# EAGLE design r2c (EAGLE 7.3.0)
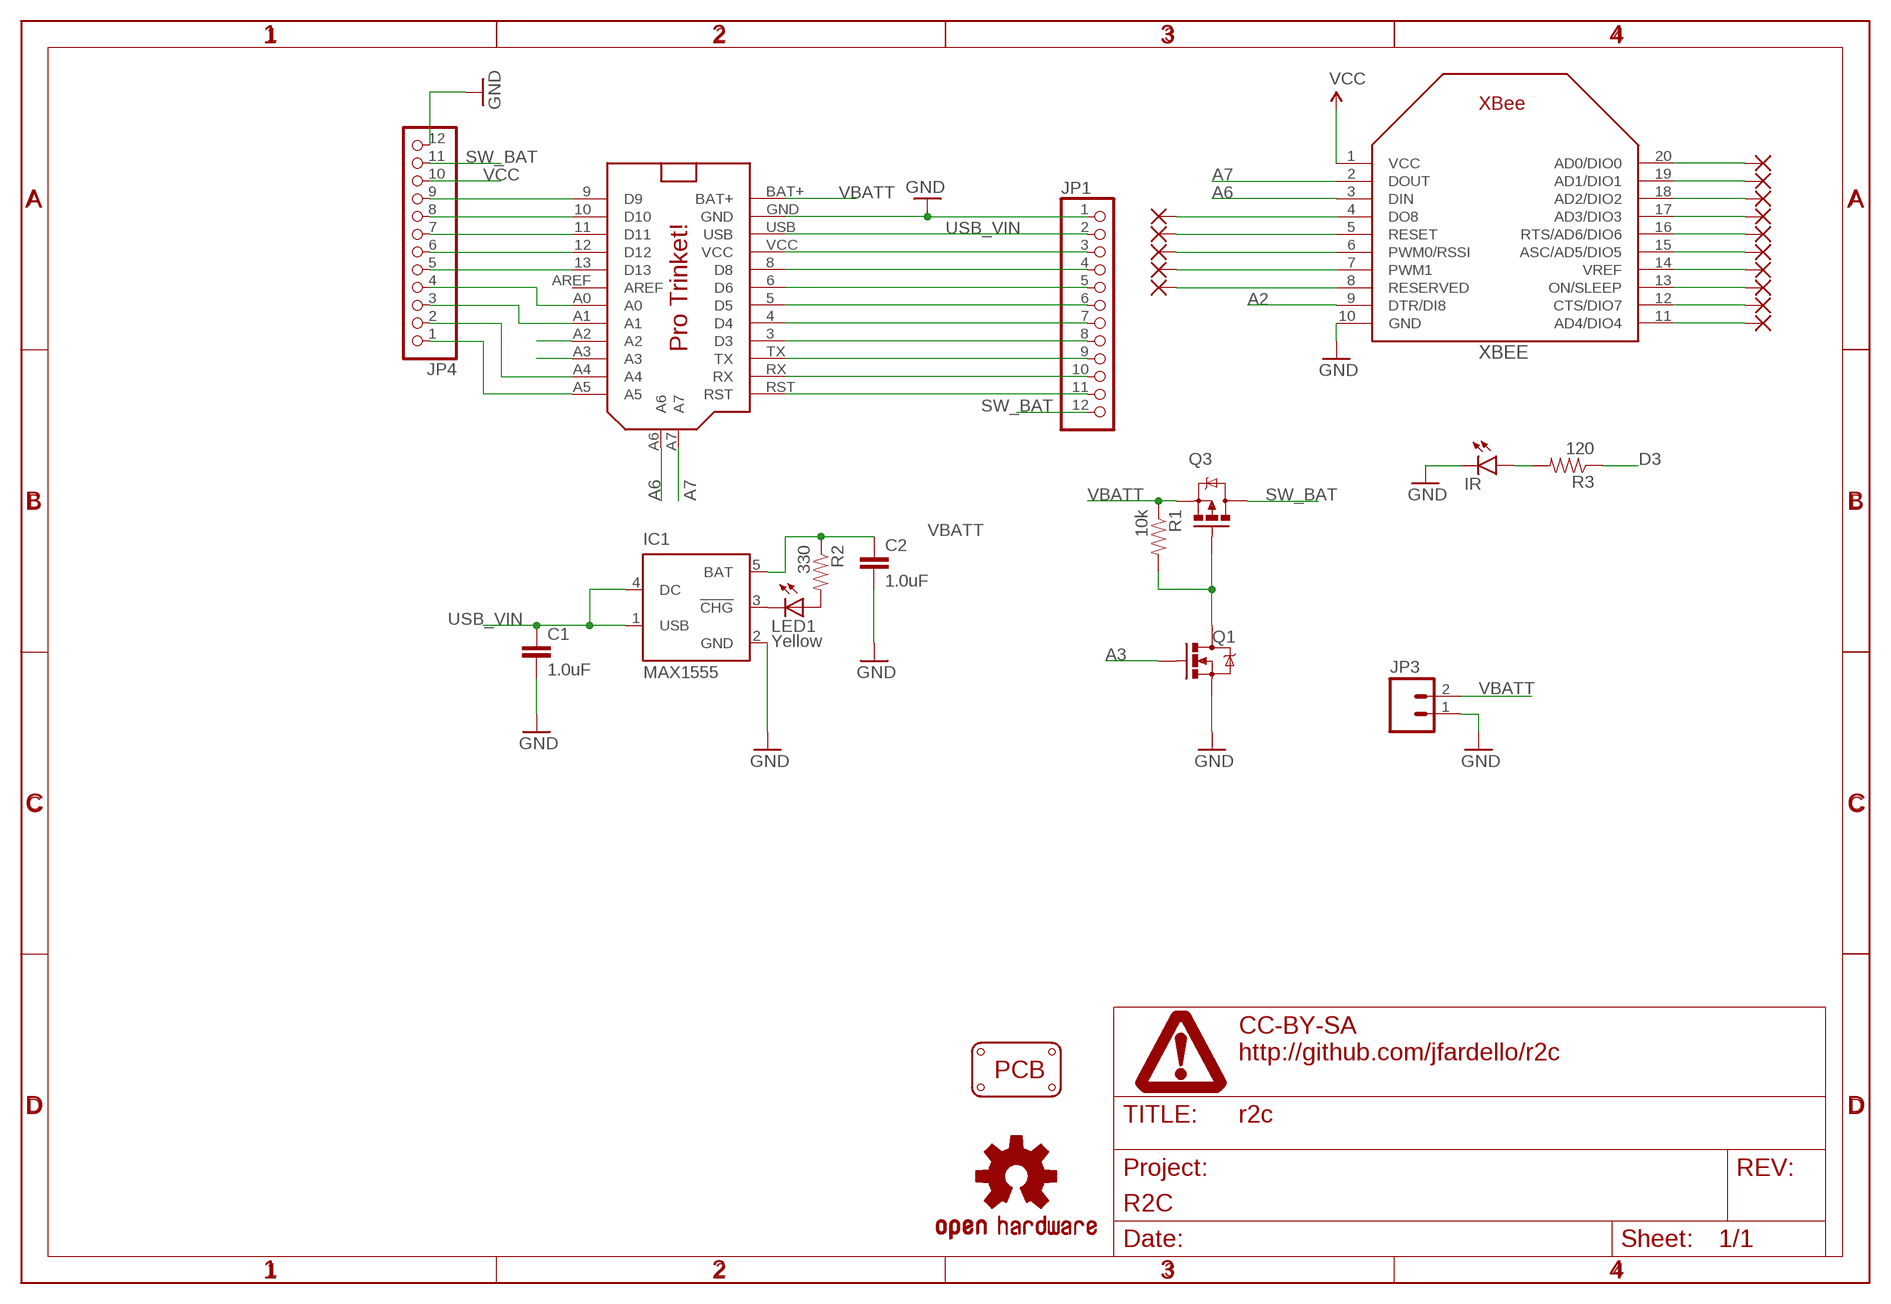
[diagram p0: schematic, sheet 1]

## Parts
C1  1.0uF  CAP0402-CAP  [0402-CAP]
C2  1.0uF  CAP0402-CAP  [0402-CAP]
IC1  MAX1555  [SOT23-5L]
IR  LED3MM  [LED3MM]
JP1  PINHD-1X12  [1X12]
JP3  M02-JST-2MM-SMT  [S2B-PH]
JP4  PINHD-1X12  [1X12]
LED1  Yellow  LED0603  [LED-0603]
LOGO1  OSHW-LOGOS  [OSHW-LOGO-S]
PAD1  SMD2  [SMD1,27-2,54]
PAD2  SMD2  [SMD1,27-2,54]
PAD3  SMD2  [SMD1,27-2,54]
PAD4  SMD2  [SMD1,27-2,54]
PAD5  SMD2  [SMD1,27-2,54]
PAD6  SMD2  [SMD1,27-2,54]
PAD7  SMD2  [SMD1,27-2,54]
PAD8  SMD2  [SMD1,27-2,54]
PAD9  SMD2  [SMD1,27-2,54]
PAD10  SMD2  [SMD1,27-2,54]
PAD11  SMD2  [SMD1,27-2,54]
PAD12  SMD2  [SMD1,27-2,54]
PAD13  SMD2  [SMD1,27-2,54]
PAD14  SMD2  [SMD1,27-2,54]
PAD15  SMD2  [SMD1,27-2,54]
PCB1  PCB_DP_RECTANGLE-37X60  [DP6037_V1]
Q1  MOSFET-NCHANNEL2N7002PW  [SOT323]
Q3  MOSFET-PCHANNELIRLML2244  [SOT23-3]
R1  10k  RESISTOR0402-RES  [0402-RES]
R2  330  RESISTOR0402-RES  [0402-RES]
R3  120  RESISTOR0402-RES  [0402-RES]
U$1  PRO_TRINKET  [PROTRINKET]
U$2  FRAME_DINA4_L  [DP_LOGO]
XBEE  XBEE  [XBEE]

## Nets
A2: U$1.A2 XBEE.9(DTR/DI8)
A3: Q1.1(G) U$1.A3
A4: JP4.2 U$1.A4
A5: JP4.1 U$1.A5
A6: U$1.A6 XBEE.3(DIN)
A7: U$1.A7 XBEE.2(DOUT)
D3: JP1.8 R3.1 U$1.3(D3)
GND: C1.2 C2.2 IC1.2(GND) IR.K(C) JP1.1 JP3.1 JP4.12 Q1.2(S) U$1.GND XBEE.10(GND)
N$1: Q1.3(D) Q3.1(G) R1.2
N$2: IR.A R3.2
N$3: JP1.4 U$1.8(D8)
N$4: IC1.3(!CHG) LED1.C
N$5: LED1.A R2.2
N$6: JP1.5 U$1.6(D6)
N$7: PAD1.1(P) XBEE.20(AD0/DIO0)
N$8: JP1.6 U$1.5(D5)
N$9: JP1.7 U$1.4(D4)
N$10: PAD2.1(P) XBEE.19(AD1/DIO1)
N$11: JP1.9 U$1.TX
N$12: JP1.10 U$1.RX
N$13: JP1.11 U$1.RST
N$14: PAD3.1(P) XBEE.18(AD2/DIO2)
N$15: PAD4.1(P) XBEE.17(AD3/DIO3)
N$16: PAD5.1(P) XBEE.16(RTS/AD6/DIO6)
N$17: PAD6.1(P) XBEE.15(ASC/AD5/DIO5)
N$18: JP4.3 U$1.A1
N$19: JP4.4 U$1.A0
N$20: PAD7.1(P) XBEE.14(VREF)
N$21: JP4.5 U$1.13(D13)
N$22: JP4.6 U$1.12(D12)
N$23: JP4.7 U$1.11(D11)
N$24: JP4.8 U$1.10(D10)
N$25: JP4.9 U$1.9(D9)
N$26: PAD8.1(P) XBEE.13(ON/SLEEP)
N$27: PAD9.1(P) XBEE.12(CTS/DIO7)
N$28: PAD10.1(P) XBEE.11(AD4/DIO4)
N$29: PAD11.1(P) XBEE.4(DO8)
N$30: PAD12.1(P) XBEE.5(RESET)
N$31: PAD13.1(P) XBEE.6(PWM0/RSSI)
N$32: PAD14.1(P) XBEE.7(PWM1)
N$33: PAD15.1(P) XBEE.8(RESERVED)
SW_BAT: JP1.12 JP4.11 Q3.3(D)
USB_VIN: C1.1 IC1.1(USB) IC1.4(DC) JP1.2 U$1.USB
VBATT: C2.1 IC1.5(BAT) JP3.2 Q3.2(S) R1.1 R2.1 U$1.BAT+
VCC [VCC]: JP1.3 JP4.10 U$1.VCC XBEE.1(VCC)
Unconnected: U$1.AREF

## Library data of the parts
C1 C2 = SparkFun:CAP: Capacitor Standard 0603 ceramic capacitor, and 0.1" leaded capacitor.
IC1 = maxim:MAX1555: Dual-Input USB/AC Adapter 1-Cell Li+ Battery Chargers Source: http://www.maxim-ic.com .. MAX1551-MAX1555.pdf; MF: MAXIM; MPN: MAX1555EZK+T; OC_FARNELL: 1628222; OC_NEWARK: 59J2761
IR = SparkFun-LED:LED: LEDs Standard schematic elements and footprints for 5mm, 3mm, 1206, and 0603 sized LEDs. 5mm - Spark Fun Electronics SKU : COM-00529 (and others)
JP1 JP4 = pinhead:PINHD-1X12: PIN HEADER
JP3 = SparkFun:M02: Header 2 Standard 2-pin 0.1" header. Use with straight break away headers (SKU : PRT-00116), right angle break away headers (PRT-00553), swiss pins (PRT-00743), machine pins (PRT-00117), and female headers (PRT-00115). Molex polarized connector foot print use with SKU : PRT-08233 with associated crimp pins and housings.
LED1 = SparkFun:LED: LEDs Standard schematic elements and footprints for 5mm, 3mm, 1206, and 0603 sized LEDs. 5mm - Spark Fun Electronics SKU : COM-00529 (and others)
LOGO1 = SparkFun-Aesthetics:OSHW-LOGO: Open Source Hardware Logo This logo indicates the piece of hardware it is found on incorporates a OSHW license and/or adheres to the definition of open source hardware found here: http://freedomdefined.org/OSHW
PAD1-PAD15 = wirepad:SMD2: SMD PAD
PCB1 = dp_devices:PCB_DP_RECTANGLE: Dangerous Prototypes Standard Rectangular PCB sizes; PCB_SIZE: DP6037_V1
Q1 = SparkFun-DiscreteSemi:MOSFET-NCHANNEL: Common NMOSFET Parts MFG P/N Store ID Prod ID FDD8780 TRANS-09984 SI7820DN TRANS-11055 FDS6630A IC-08089 2N7002PW TRANS-11151 FQP30N06L COM-10213 TRANS-10060 BSS123LT1G TRANS-08345 BSS138 TRANS-00830 BS170 2N7000; PROD_ID: TRANS-11151
Q3 = SparkFun-DiscreteSemi:MOSFET-PCHANNEL: Generic PMOSFET IRLML2244 - TRANS-11153 (SOT-23 -20V -4.3A) (1.Gate 2.Source 3.Drain) FQP27P06 - COM-10349 <http://www.sparkfun.com/products/10349> (TO-220 -60V -27A) (1.Gate 2.Source 3.Drain); PROD_ID: TRANS-11153
R1-R3 = SparkFun:RESISTOR: Resistor Basic schematic elements and footprints for 0603, 1206, and PTH 1/10th watt (small) resistors.
U$1 = adafruit:PRO_TRINKET
U$2 = dp_devices:FRAME_DINA4_L: A4 DP frame Standard Dangerous Prototypes schematic frame. Automagically adds the DP logo and standard texts to the PCB Use the atrribute in the schematic editor to change the fields.; FF1: fulfillment by; FF2: Seeed Studio; FF3: www.seeedstudio.com; LICENSE: CC-BY-SA; PROJECT: R2C; URL1: http://github.com/jfardello/r2c
XBEE = adafruit:XBEE

## Net classes
0 Default: width 0.203 mm
1 VCC: width 0.381 mm
2 LEDPower: width 0.203 mm
3 ButtonSignal: width 0.203 mm

## Board
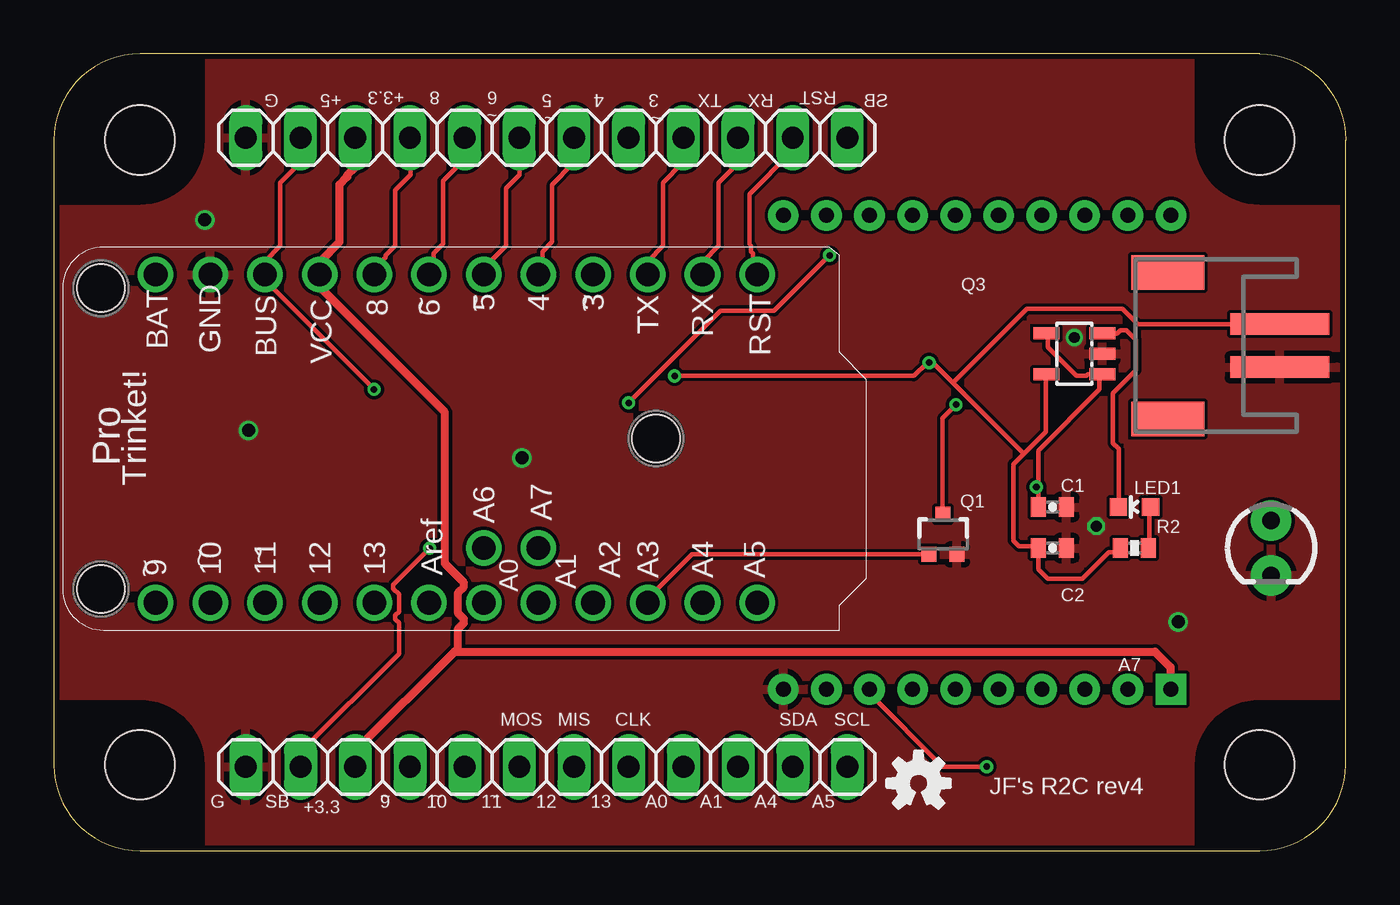
[diagram p1: board, top side]
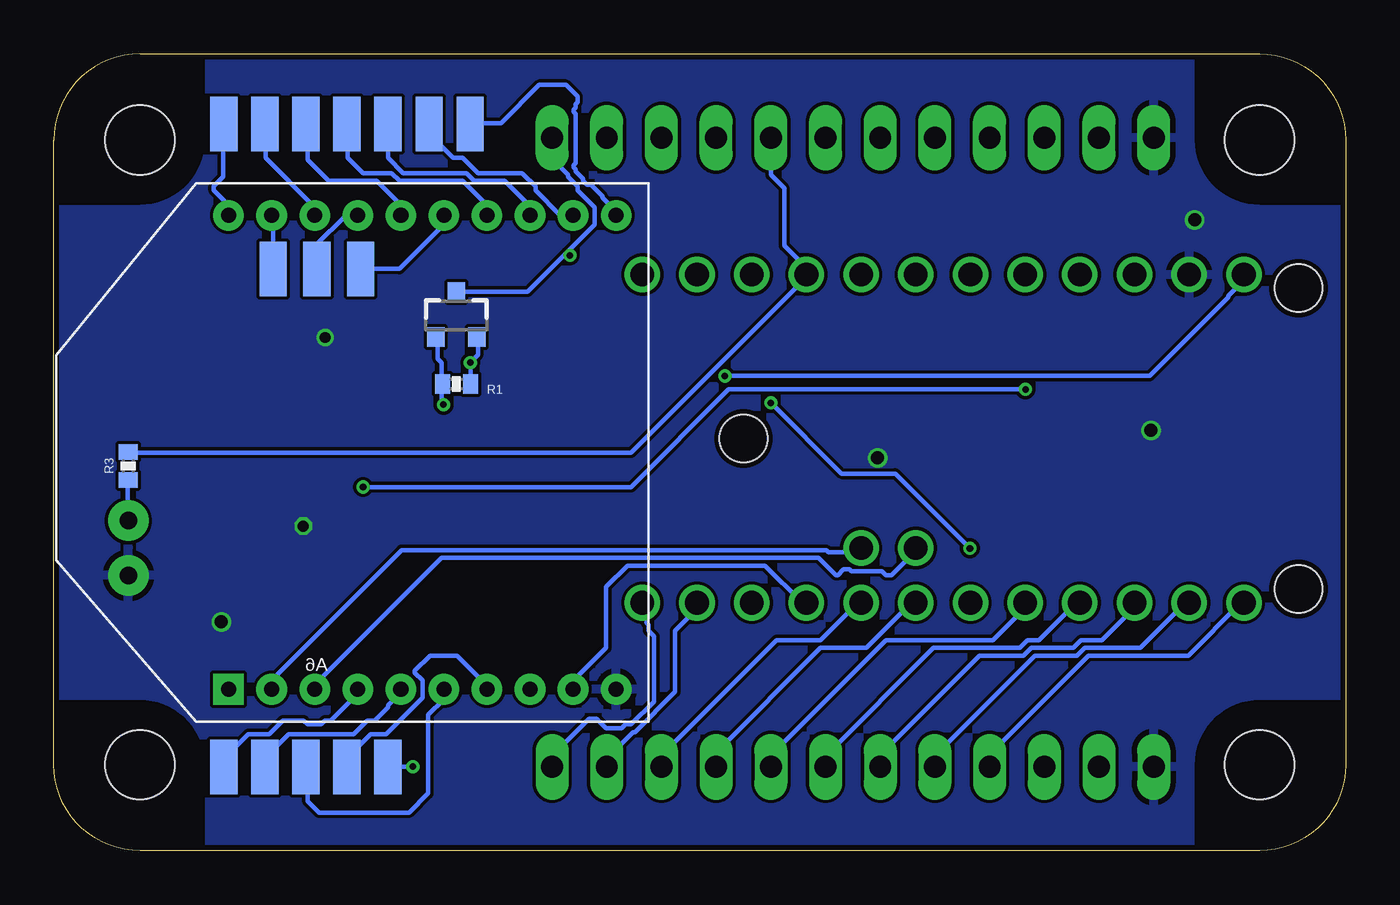
[diagram p2: board, bottom side, seen from below]

Size 60 x 37 mm. Coordinates in mm from the lower left corner, seen from the top.
Copper layers (1*16): Top 0.035mm / dielectric 1.5mm / Bottom 0.035mm
Design rules "SeeedStudio_2layer_DRU_no_angle_20140221 *": minimum track width 6mil, minimum drill 12mil, track to track 6mil, track to pad 6mil, pad to pad 6mil, via to via 6mil, smd to smd 0mil, copper to edge 10mil, drill to drill 10mil, minimum pad ring 10mil, minimum via ring 6mil, stop-mask expansion 2mil, vias tented up to drill 100mil, thermal gap 10mil

### Footprints (pad centres in the part's own frame; a part is rotated, then mirrored left to right if it is on the bottom)
0402-CAP = smd 0.7 x 0.9: 1 -0.65,0; 2 0.65,0
SOT23-5L = smd 0.55 x 1.2: 1 -0.95,-1.3; 2 0,-1.3; 3 0.95,-1.3; 4 0.95,1.3; 5 -0.95,1.3
LED3MM = drill 0.813 pad 1.88: A -1.27,0; K 1.27,0
1X12 = drill 1.016 long: 1 -13.97,0; 2 -11.43,0; 3 -8.89,0; 4 -6.35,0; 5 -3.81,0; 6 -1.27,0; 7 1.27,0; 8 3.81,0; 9 6.35,0; 10 8.89,0; 11 11.43,0; 12 13.97,0
S2B-PH = smd 1 x 4.6: 1 -1,-3.7; 2 1,-3.7 | smd 1.6 x 3.4: NC1 -3.4,1.5; NC2 3.4,1.5
LED-0603 = smd 0.8 x 0.8: A 0,-0.75; C 0,0.75
SMD1,27-2,54 = smd 1.27 x 2.54: 1 0,0
DP6037_V1 = hole 3.2: -26,-14.5; 26,-14.5; 26,14.5; -26,14.5
SOT323 = smd 0.7 x 0.7: 1 -0.65,-0.925; 2 0.65,-0.925; 3 0,0.925
SOT23-3 = smd 0.8 x 0.9: 1 -0.95,-1; 2 0.95,-1; 3 0,1.1
0402-RES = smd 0.7 x 0.9: 1 -0.65,0; 2 0.65,0
PROTRINKET = drill 1.1: 3 7.62,2.921; 4 7.62,5.461; 5 7.62,8.001; 6 7.62,10.541; 8 7.62,13.081; 9 -7.62,23.241; 10 -7.62,20.701; 11 -7.62,18.161; 12 -7.62,15.621; 13 -7.62,13.081; A0 -7.62,8.001; A1 -7.62,5.461; A2 -7.62,2.921; A3 -7.62,0.381; A4 -7.62,-2.159; A5 -7.62,-4.699; A6 -5.08,8.001; A7 -5.08,5.461; AREF -7.62,10.541; BAT+ 7.62,23.241; GND 7.62,20.701; RST 7.62,-4.699; RX 7.62,-2.159; TX 7.62,0.381; USB 7.62,18.161; VCC 7.62,15.621 | hole 2.2: -6.985,25.781; 6.985,25.781; 0,0
XBEE = drill 0.7 pad 1.422 square: 1 -11,5.5 | drill 0.7 pad 1.422: 2 -11,3.5; 3 -11,1.5; 4 -11,-0.5; 5 -11,-2.5; 6 -11,-4.5; 7 -11,-6.5; 8 -11,-8.5; 9 -11,-10.5; 10 -11,-12.5; 11 11,-12.5; 12 11,-10.5; 13 11,-8.5; 14 11,-6.5; 15 11,-4.5; 16 11,-2.5; 17 11,-0.5; 18 11,1.5; 19 11,3.5; 20 11,5.5

### Placement (x,y rotation side)
C1  46.38,15.96 0 top
C2  46.38,14.06 0 top
IC1  47.4,23.07 90 top
IR  56.54,14.06 270 top
JP1  22.89,33.11 0 top
JP3  53.24,23.45 90 top
JP4  22.89,3.9 180 top
LED1  50.19,15.96 90 top
LOGO1  40.16,3.13 0 top
PAD1  52.1,33.74 0 bottom
PAD2  49.81,27.01 0 bottom
PAD3  50.19,33.74 0 bottom
PAD4  47.78,27.01 0 bottom
PAD5  48.29,33.74 0 bottom
PAD6  45.75,27.01 0 bottom
PAD7  46.38,33.74 0 bottom
PAD8  44.48,33.74 0 bottom
PAD9  42.57,33.74 0 bottom
PAD10  40.67,33.74 0 bottom
PAD11  52.1,3.9 0 bottom
PAD12  50.19,3.9 0 bottom
PAD13  48.29,3.9 0 bottom
PAD14  46.38,3.9 0 bottom
PAD15  44.48,3.9 0 bottom
PCB1  30,18.5 0 top
Q1  41.3,14.69 0 top
Q3  41.3,24.85 0 bottom
R1  41.3,21.68 180 bottom
R2  50.19,14.06 0 top
R3  56.54,17.87 270 bottom
U$1  27.97,19.14 90 top
U$2  2.57,-6.26 0 top  (outside the outline)
XBEE  46.38,18.5 90 bottom

### Tracks (layer width: path | path; a pad name or v marks a point on that pad's centre or on a via)
A2
  Bottom 0.203: XBEE.9 35.85,7.55 35.85,7.91 34.34,9.42 34.34,12.26 33.37,13.24 26.96,13.24 25.28,11.55 25.1,11.55 U$1.A2
A3
  Top 0.203: U$1.A3 27.59,11.73 29.63,13.78 40.57,13.78 Q1.1
A4
  Bottom 0.203: JP4.2 34.25,3.91 34.25,4.35 33.1,5.51 33.01,5.51 31.14,7.38 31.14,10.22 30.16,11.2 30.16,11.46 U$1.A4
A5
  Bottom 0.203: JP4.1 36.83,3.91 36.83,4.44 35.14,6.13 34.79,6.13 34.34,5.69 33.63,5.69 33.45,5.86 33.19,5.86 32.12,6.93 32.12,9.95 32.39,10.22 32.39,10.49 32.48,10.58 32.48,11.29 32.65,11.46 U$1.A5
A6
  Bottom 0.203: XBEE.3 47.86,7.55 47.86,7.73 41.99,13.6 24.48,13.6 23.67,12.8 23.59,12.8 23.32,13.06 23.05,13.06 22.96,12.98 21.54,12.98 21.36,12.8 21.1,12.8 20.03,13.87 20.03,14.04 U$1.A6
A7
  Bottom 0.203: XBEE.2 49.81,7.55 49.81,8 43.86,13.95 24.12,13.95 24.03,13.87 23.32,13.87 23.14,14.04 22.52,14.04 U$1.A7
D3
  Bottom 0.203: R3.1 56.48,18.49 33.19,18.49 25.1,26.58 25.1,26.76 U$1.3 25.1,26.84 25.1,27.11 26.08,28.09 26.08,30.76 26.7,31.38 JP1.8
GND  (via drill 0.5, 0.6)
  other vias: 7.01,29.3 48.41,15.07 21.74,18.25 9.04,19.52 47.4,23.83 52.23,10.63
  pour Bottom: -1.88,38.82 62.89,38.82 62.89,37.55 62.89,-1.82 -2.51,-1.82 -2.51,-1.18 -2.51,38.82
  pour Top: -3.15,39.45 64.16,39.45 64.16,37.55 64.16,-3.09 -3.15,-3.09 -3.15,-2.45
N$1  (via drill 0.3)
  Top 0.203: v41.9,20.71 41.28,20.09 41.28,15.64 Q1.3
  Bottom 0.203: v41.9,20.71 41.99,20.8 41.99,21.6 R1.2 41.99,21.69 41.99,22.67 42.17,22.84 42.17,23.82 Q3.1
N$2
  Bottom 0.203: R3.2 56.57,17.15 56.57,15.38 IR.A
N$3
  Top 0.203: JP1.4 16.56,33.07 16.56,31.38 15.85,30.67 15.85,28.09 15.41,27.64 15.41,27.55 14.96,27.11 14.96,26.76 U$1.8
N$4
  Top 0.203: LED1.C 49.46,16 49.46,18.66 49.19,18.93 49.19,21.24 50.26,22.31 50.26,23.73 49.81,24.18 49.55,24.18 49.37,24 48.74,24 IC1.3
N$5
  Top 0.203: LED1.A 50.88,15.91 50.88,14.13 R2.2
N$6
  Top 0.203: JP1.5 19.05,33.07 19.05,32.09 18.07,31.11 18.07,28.18 17.63,27.73 17.63,27.55 17.45,27.38 17.45,26.76 U$1.6
N$7
  Bottom 0.203: PAD1.1 52.12,33.69 52.12,31.29 52.57,30.84 52.57,30.67 51.95,30.04 51.95,29.51 XBEE.20
N$8
  Top 0.203: JP1.6 21.63,33.07 21.63,31.38 21.01,30.76 21.01,28.09 20.03,27.11 20.03,26.76 U$1.5
N$9
  Top 0.203: JP1.7 24.12,33.07 24.12,31.91 23.14,30.93 23.14,28.27 22.7,27.82 22.7,27.55 22.52,27.38 22.52,26.76 U$1.4
N$10
  Bottom 0.203: PAD2.1 49.81,29.42 XBEE.19
N$11
  Top 0.203: U$1.TX 27.59,27.38 28.3,28.09 28.3,31.02 29.19,31.91 29.19,33.07 JP1.9
N$12
  Top 0.203: JP1.10 31.76,33.07 31.76,31.91 30.88,31.02 30.88,28.09 30.16,27.38 30.16,26.76 U$1.RX
N$13
  Top 0.203: JP1.11 34.25,33.07 34.25,32.45 32.3,30.49 32.3,28.18 32.39,28.09 32.39,27.82 32.48,27.73 32.48,27.55 32.65,27.38 32.65,26.76 U$1.RST
N$14
  Bottom 0.203: PAD3.1 50.17,33.69 50.17,32.18 47.95,29.96 47.95,29.51 XBEE.18
N$15
  Bottom 0.203: PAD4.1 47.77,27.02 47.77,28.18 46.52,29.42 45.9,29.42 XBEE.17
N$16
  Bottom 0.203: PAD5.1 48.21,33.69 48.21,32.09 47.23,31.11 45.01,31.11 43.95,30.04 43.95,29.51 XBEE.16
N$17
  Bottom 0.203: PAD6.1 45.72,27.02 43.95,27.02 41.9,29.07 41.9,29.42 XBEE.15
N$18
  Bottom 0.203: JP4.3 31.76,3.91 31.76,4.44 26.43,9.78 24.39,9.78 22.7,11.46 22.52,11.46 U$1.A1
N$19
  Bottom 0.203: JP4.4 29.19,3.91 29.19,4.62 24.39,9.42 22.25,9.42 20.21,11.46 20.03,11.46 U$1.A0
N$20
  Bottom 0.203: PAD7.1 46.34,33.69 46.34,32.18 45.63,31.47 44.3,31.47 43.95,31.11 41.01,31.11 39.94,30.04 39.94,29.51 XBEE.14
N$21
  Bottom 0.203: JP4.5 26.7,4.44 21.36,9.78 16.39,9.78 14.96,11.2 14.96,11.46 U$1.13
N$22
  Bottom 0.203: JP4.6 24.12,3.91 24.12,4.44 19.14,9.42 15.14,9.42 14.78,9.78 14.25,9.78 12.56,11.46 12.38,11.46 U$1.12
N$23
  Bottom 0.203: U$1.11 9.81,11.29 11.32,9.78 12.3,9.78 12.65,9.42 14.61,9.42 14.96,9.06 17.01,9.06 21.54,4.53 21.54,3.91 JP4.7
N$24
  Bottom 0.203: JP4.8 19.05,3.91 19.05,4.44 14.43,9.06 12.47,9.06 12.12,9.42 9.54,9.42 7.5,11.46 7.32,11.46 U$1.10
N$25
  Bottom 0.203: JP4.9 16.47,3.91 16.47,4.53 11.94,9.06 7.32,9.06 4.92,11.46 4.74,11.46 U$1.9
N$26
  Bottom 0.203: PAD8.1 44.48,32.18 43.77,31.47 40.83,31.47 40.48,31.11 39.05,31.11 37.9,29.96 37.9,29.51 XBEE.13
N$27
  Bottom 0.203: PAD9.1 42.52,33.69 42.52,33.24 41.45,32.18 41.01,32.18 40.3,31.47 38.25,31.47 37.63,30.84 37.63,30.67 36.48,29.51 35.94,29.51 XBEE.12
N$28
  Bottom 0.203: PAD10.1 40.66,33.78 39.23,33.78 37.45,35.56 36.21,35.56 35.68,35.02 35.68,34.76 35.77,34.67 35.77,34.49 35.85,34.4 35.85,34.31 35.77,34.22 35.77,31.91 35.85,31.82 35.85,31.73 35.77,31.64 35.77,31.56 35.41,31.2 35.41,31.11 35.23,30.93 35.05,30.93 34.52,30.4 34.52,30.31 33.9,29.69 33.9,29.51 XBEE.11
N$29
  Bottom 0.203: PAD11.1 52.03,3.91 52.03,4.35 50.97,5.42 49.99,5.42 49.37,6.04 48.39,6.04 48.21,5.86 47.59,5.86 47.41,6.04 47.14,6.04 45.9,7.29 45.9,7.46 XBEE.4
N$30
  Bottom 0.203: PAD12.1 50.17,3.91 50.17,4.35 49.1,5.42 46.08,5.42 45.46,6.04 45.1,6.04 44.48,6.66 44.48,6.75 43.95,7.29 43.95,7.46 XBEE.5
N$31
  Bottom 0.203: PAD13.1 48.21,3.82 48.21,2.31 47.68,1.77 43.5,1.77 42.61,2.66 42.61,6.31 41.9,7.02 41.9,7.46 XBEE.6
N$32
  Bottom 0.203: PAD14.1 46.34,3.91 46.34,4.35 45.28,5.42 44.57,5.42 42.88,7.11 42.88,7.91 43.23,8.26 43.23,8.35 42.52,9.06 41.28,9.06 39.94,7.73 39.94,7.55 XBEE.7
N$33  (via drill 0.3)
  Top 0.203: v43.32,3.91 41.28,3.91 37.9,7.29 37.9,7.46 XBEE.8
  Bottom 0.203: v43.32,3.91 44.48,3.91 PAD15.1
SW_BAT  (via drill 0.3)
  Top 0.203: v17.45,14.04 15.76,12.35 15.76,12.18 16.03,11.91 16.03,11.11 15.85,10.93 15.85,10.75 16.03,10.58 16.03,9.15 11.5,4.62 11.5,3.91 JP4.11 | v26.7,20.8 30.96,25.07 33.45,25.07 v36.03,27.64
  Bottom 0.203: 36.17,27.78 34.88,29.07 34.88,29.87 35.68,30.67 35.68,30.84 36.12,31.29 36.12,31.38 36.83,32.09 36.83,33.07 JP1.12 | 36.17,27.78 37.99,25.96 41.28,25.96 Q3.3 | v17.45,14.04 20.92,17.51 23.41,17.51 v26.7,20.8 | 36.17,27.78 v36.03,27.64
USB_VIN  (via drill 0.3)
  Top 0.203: 45.72,16.89 45.72,18.58 48.57,21.42 48.57,21.95 48.66,22.04 IC1.1 48.48,21.95 48.3,22.13 48.03,22.13 47.95,22.04 47.5,22.04 46.17,23.38 46.17,24 IC1.4 | 45.72,16.89 45.72,16 C1.1 | JP1.2 11.41,33.07 11.41,31.91 10.52,31.02 10.52,28.09 9.81,27.38 U$1.USB 9.81,26.49 v14.87,21.42 | v45.63,16.89 45.72,16.89
  Bottom 0.203: v45.63,16.89 33.19,16.89 28.65,21.42 v14.87,21.42
VBATT  (via drill 0.3)
  Top 0.203: R2.1 49.46,14.04 49.28,13.87 49.01,13.87 47.77,12.62 46.17,12.62 45.72,13.06 45.72,14.04 C2.1 45.72,14.13 44.83,14.13 44.57,14.4 44.57,17.95 45.06,18.44 | 45.06,18.44 46.08,19.46 46.08,22.04 IC1.5 | 45.06,18.44 41.77,21.73 | 41.77,21.73 40.83,22.67 v40.66,22.67 40.57,22.67 39.94,22.04 v28.83,22.04 | 41.77,21.73 45.19,25.16 49.63,25.16 50.34,24.44 56.92,24.44 JP3.2
  Bottom 0.203: R1.1 40.66,21.69 v40.66,22.67 40.3,23.02 40.3,23.82 Q3.2 | v28.83,22.04 9.1,22.04 5.45,25.69 5.45,25.78 4.74,26.49 4.74,26.76 U$1.BAT+
VCC
  Top 0.381: JP1.3 13.98,33.07 13.98,31.73 13.63,31.38 13.63,31.29 13.27,30.93 13.27,28.27 12.38,27.38 12.38,26.76 U$1.VCC 12.47,26.58 12.47,26.04 18.16,20.35 18.16,13.33 19.05,12.44 19.05,12.26 18.79,12 18.79,11.02 19.05,10.75 19.05,10.58 18.79,10.31 18.79,9.24 | 18.79,9.24 18.61,9.24 14.07,4.71 14.07,3.91 JP4.10 | 18.79,9.24 51.14,9.24 51.86,8.53 51.86,7.55 XBEE.1

### Text on the board
tNames: G | +5 | +3.3 | 8 | 6 | 5 | 4 | 3 | TX | RX | RST | SB | ~ | ~ | ~ | A7 | MOS | MIS | CLK | SDA | SCL | JF's R2C rev4 | G | SB | +3.3 | 9 | ~ | 10 | ~ | 11 | ~ | 12 | 13 | A0 | A1 | A4 | A5
bNames: A6